# Altium schematic sheet Glasses-LensBoard.SchDoc
size A4
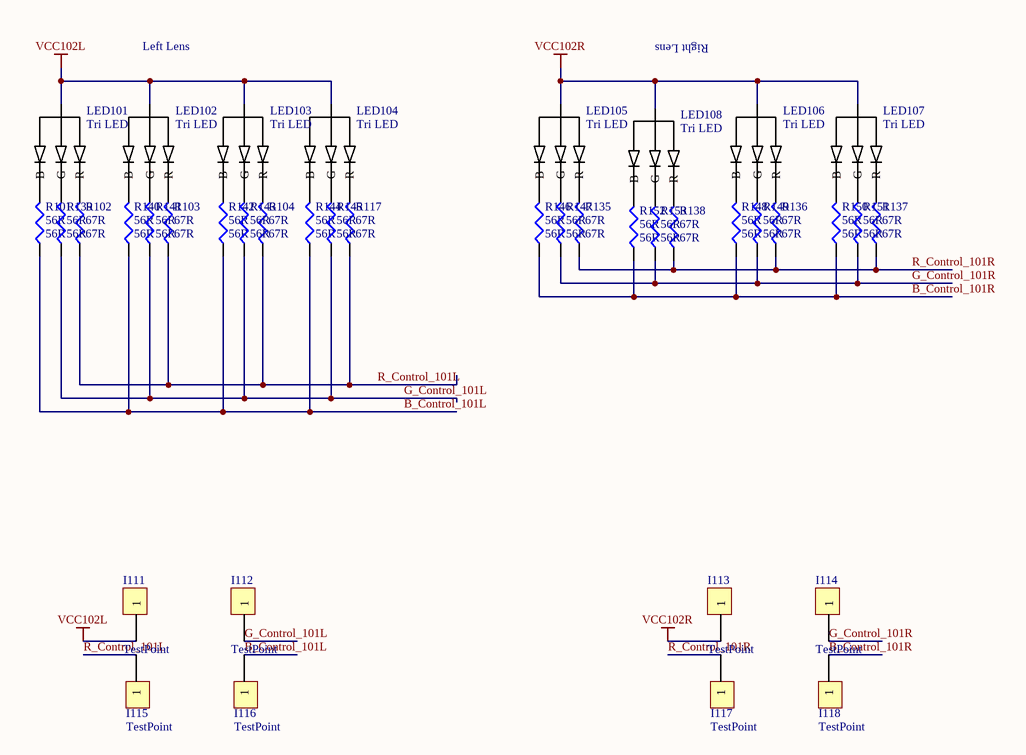
[diagram p0: Glasses-LensBoard.SchDoc]

## Parts
I111  TestPoint  [TestPoint]
I112  TestPoint  [TestPoint]
I113  TestPoint  [TestPoint]
I114  TestPoint  [TestPoint]
I115  TestPoint  [TestPoint]
I116  TestPoint  [TestPoint]
I117  TestPoint  [TestPoint]
I118  TestPoint  [TestPoint]
LED101  Tri LED  [CLV1A-FKB]
LED102  Tri LED  [CLV1A-FKB]
LED103  Tri LED  [CLV1A-FKB]
LED104  Tri LED  [CLV1A-FKB]
LED105  Tri LED  [CLV1A-FKB]
LED106  Tri LED  [CLV1A-FKB]
LED107  Tri LED  [CLV1A-FKB]
LED108  Tri LED  [CLV1A-FKB]
R101  56R  [0603]
R102  67R  [0603]
R103  67R  [0603]
R104  67R  [0603]
R117  67R  [0603]
R135  67R  [0603]
R136  67R  [0603]
R137  67R  [0603]
R138  67R  [0603]
R139  56R  [0603]
R140  56R  [0603]
R141  56R  [0603]
R142  56R  [0603]
R143  56R  [0603]
R144  56R  [0603]
R145  56R  [0603]
R146  56R  [0603]
R147  56R  [0603]
R148  56R  [0603]
R149  56R  [0603]
R150  56R  [0603]
R151  56R  [0603]
R152  56R  [0603]
R153  56R  [0603]

## Nets
VCC102L: I111.1 LED101.2(Common) LED102.2(Common) LED103.2(Common) LED104.2(Common)
VCC102R: I113.1 LED105.2(Common) LED106.2(Common) LED107.2(Common) LED108.2(Common)
B_Control_101L: I116.1 R101.1 R140.1 R142.1 R144.1
B_Control_101R: I118.1 R146.1 R148.1 R150.1 R152.1
G_Control_101L: I112.1 R139.1 R141.1 R143.1 R145.1
G_Control_101R: I114.1 R147.1 R149.1 R151.1 R153.1
R_Control_101L: I115.1 R102.1 R103.1 R104.1 R117.1
R_Control_101R: I117.1 R135.1 R136.1 R137.1 R138.1
NetLED101_1: LED101.1(R) R102.2
NetLED101_3: LED101.3(B) R101.2
NetLED101_4: LED101.4(G) R139.2
NetLED102_1: LED102.1(R) R103.2
NetLED102_3: LED102.3(B) R140.2
NetLED102_4: LED102.4(G) R141.2
NetLED103_1: LED103.1(R) R104.2
NetLED103_3: LED103.3(B) R142.2
NetLED103_4: LED103.4(G) R143.2
NetLED104_1: LED104.1(R) R117.2
NetLED104_3: LED104.3(B) R144.2
NetLED104_4: LED104.4(G) R145.2
NetLED105_1: LED105.1(R) R135.2
NetLED105_3: LED105.3(B) R146.2
NetLED105_4: LED105.4(G) R147.2
NetLED106_1: LED106.1(R) R136.2
NetLED106_3: LED106.3(B) R148.2
NetLED106_4: LED106.4(G) R149.2
NetLED107_1: LED107.1(R) R137.2
NetLED107_3: LED107.3(B) R150.2
NetLED107_4: LED107.4(G) R151.2
NetLED108_1: LED108.1(R) R138.2
NetLED108_3: LED108.3(B) R152.2
NetLED108_4: LED108.4(G) R153.2

## Notes on the sheet
- Right Lens
- Left Lens

## Library data of the parts
R101-R104 R117 R135-R153 = Res3: Resistor; Published: 8-Jun-2000; LatestRevisionDate: 29-May-2009; LatestRevisionNote: IPC-7351 Footprint Added.; PackageReference: J1-0603; Publisher: Altium Limited; PackageDescription: Chip Resistor
  R101 R139-R153: Value: 56R
  R102-R104 R117 R135-R138: Value: 67R